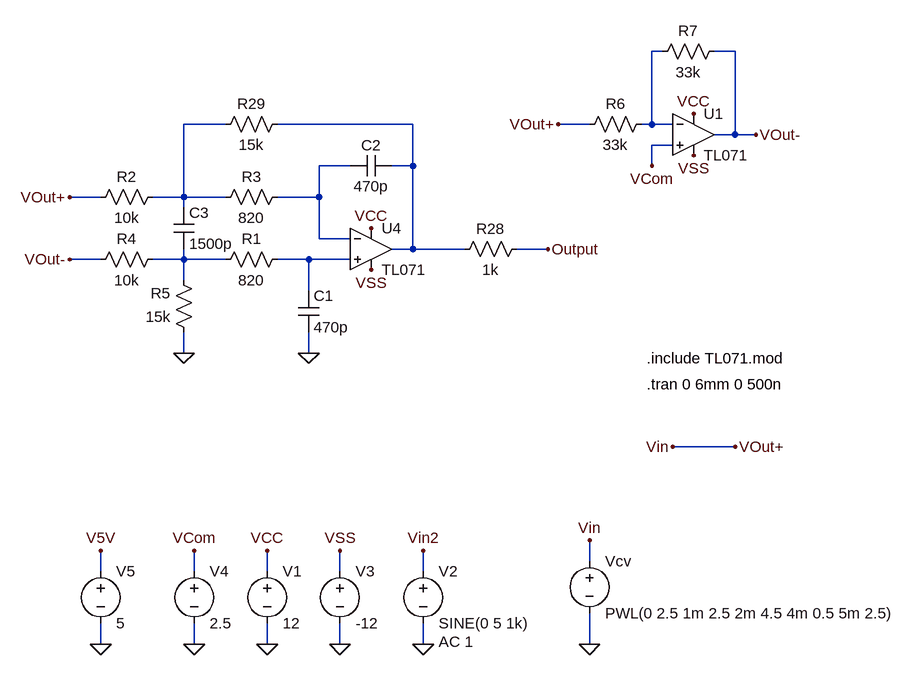
[diagram p0: schematic CodecOutput.asc]
CodecOutput.asc, the LTspice schematic file:
Version 4
SHEET 1 5572 1568
WIRE 4736 0 4720 0
WIRE 4848 0 4816 0
WIRE 4064 112 4000 112
WIRE 4352 112 4144 112
WIRE 4624 112 4576 112
WIRE 4720 112 4720 0
WIRE 4720 112 4704 112
WIRE 4752 112 4720 112
WIRE 4848 128 4848 0
WIRE 4848 128 4816 128
WIRE 4880 128 4848 128
WIRE 4752 144 4720 144
WIRE 4256 176 4208 176
WIRE 4352 176 4352 112
WIRE 4352 176 4320 176
WIRE 4720 176 4720 144
WIRE 3872 224 3824 224
WIRE 4000 224 4000 112
WIRE 4000 224 3952 224
WIRE 4064 224 4000 224
WIRE 4208 224 4208 176
WIRE 4208 224 4144 224
WIRE 4000 240 4000 224
WIRE 4208 288 4208 224
WIRE 4256 288 4208 288
WIRE 4352 304 4352 176
WIRE 4352 304 4320 304
WIRE 4432 304 4352 304
WIRE 4560 304 4512 304
WIRE 3872 320 3824 320
WIRE 4000 320 4000 304
WIRE 4000 320 3952 320
WIRE 4064 320 4000 320
WIRE 4192 320 4144 320
WIRE 4256 320 4192 320
WIRE 4000 352 4000 320
WIRE 4192 368 4192 320
WIRE 4000 464 4000 432
WIRE 4192 464 4192 432
WIRE 4848 608 4752 608
WIRE 4624 784 4624 752
WIRE 3872 800 3872 768
WIRE 4016 800 4016 768
WIRE 4128 800 4128 768
WIRE 4240 800 4240 768
WIRE 4368 800 4368 768
WIRE 3872 912 3872 880
WIRE 4016 912 4016 880
WIRE 4128 912 4128 880
WIRE 4240 912 4240 880
WIRE 4368 912 4368 880
WIRE 4624 912 4624 864
FLAG 4128 912 0
FLAG 4128 768 VCC
FLAG 4240 912 0
FLAG 4240 768 VSS
FLAG 4368 912 0
FLAG 4368 768 Vin2
FLAG 4624 912 0
FLAG 4624 752 Vin
FLAG 4288 336 VSS
FLAG 4288 272 VCC
FLAG 4560 304 Output
FLAG 3824 224 VOut+
FLAG 4016 912 0
FLAG 4016 768 VCom
FLAG 3872 912 0
FLAG 3872 768 V5V
FLAG 3824 320 VOut-
FLAG 4192 464 0
FLAG 4000 464 0
FLAG 4784 96 VCC
FLAG 4784 160 VSS
FLAG 4576 112 VOut+
FLAG 4880 128 VOut-
FLAG 4848 608 VOut+
FLAG 4752 608 Vin
FLAG 4720 176 VCom
SYMBOL voltage 4128 784 R0
WINDOW 123 0 0 Left 2
WINDOW 39 0 0 Left 2
SYMATTR InstName V1
SYMATTR Value 12
SYMBOL voltage 4368 784 R0
WINDOW 123 24 124 Left 2
WINDOW 39 0 0 Left 2
SYMATTR Value2 AC 1
SYMATTR InstName V2
SYMATTR Value SINE(0 5 1k)
SYMBOL voltage 4240 784 R0
WINDOW 123 0 0 Left 2
WINDOW 39 0 0 Left 2
SYMATTR InstName V3
SYMATTR Value -12
SYMBOL voltage 4624 768 R0
WINDOW 123 24 124 Left 2
WINDOW 39 0 0 Left 2
SYMATTR InstName Vcv
SYMATTR Value PWL(0 2.5 1m 2.5 2m 4.5 4m 0.5 5m 2.5)
SYMBOL opamp2 4288 240 R0
SYMATTR InstName U4
SYMATTR Value TL071
SYMBOL res 4528 288 R90
WINDOW 0 0 56 VBottom 2
WINDOW 3 32 56 VTop 2
SYMATTR InstName R28
SYMATTR Value 1k
SYMBOL res 4160 96 R90
WINDOW 0 0 56 VBottom 2
WINDOW 3 32 56 VTop 2
SYMATTR InstName R29
SYMATTR Value 15k
SYMBOL cap 4320 160 R90
WINDOW 0 0 32 VBottom 2
WINDOW 3 32 32 VTop 2
SYMATTR InstName C2
SYMATTR Value 470p
SYMBOL voltage 4016 784 R0
WINDOW 123 0 0 Left 2
WINDOW 39 0 0 Left 2
SYMATTR InstName V4
SYMATTR Value 2.5
SYMBOL res 4160 208 R90
WINDOW 0 0 56 VBottom 2
WINDOW 3 32 56 VTop 2
SYMATTR InstName R3
SYMATTR Value 820
SYMBOL voltage 3872 784 R0
WINDOW 123 0 0 Left 2
WINDOW 39 0 0 Left 2
SYMATTR InstName V5
SYMATTR Value 5
SYMBOL res 4160 304 R90
WINDOW 0 0 56 VBottom 2
WINDOW 3 32 56 VTop 2
SYMATTR InstName R1
SYMATTR Value 820
SYMBOL cap 4176 368 R0
SYMATTR InstName C1
SYMATTR Value 470p
SYMBOL res 3968 208 R90
WINDOW 0 0 56 VBottom 2
WINDOW 3 32 56 VTop 2
SYMATTR InstName R2
SYMATTR Value 10k
SYMBOL res 3968 304 R90
WINDOW 0 0 56 VBottom 2
WINDOW 3 32 56 VTop 2
SYMATTR InstName R4
SYMATTR Value 10k
SYMBOL cap 3984 240 R0
SYMATTR InstName C3
SYMATTR Value 1500p
SYMBOL res 4016 448 R180
WINDOW 0 36 76 Left 2
WINDOW 3 36 40 Left 2
SYMATTR InstName R5
SYMATTR Value 15k
SYMBOL opamp2 4784 64 R0
SYMATTR InstName U1
SYMATTR Value TL071
SYMBOL res 4720 96 R90
WINDOW 0 0 56 VBottom 2
WINDOW 3 32 56 VTop 2
SYMATTR InstName R6
SYMATTR Value 33k
SYMBOL res 4832 -16 R90
WINDOW 0 0 56 VBottom 2
WINDOW 3 32 56 VTop 2
SYMATTR InstName R7
SYMATTR Value 33k
TEXT 4712 472 Left 2 !.include TL071.mod
TEXT 4712 512 Left 2 !.tran 0 6mm 0 500n

The netlist it stands for:
* CodecOutput.asc
V1 VCC 0 12
V2 Vin2 0 SINE(0 5 1k) AC 1
V3 VSS 0 -12
Vcv VOut+ 0 PWL(0 2.5 1m 2.5 2m 4.5 4m 0.5 5m 2.5)
XU4 N006 N004 VCC VSS N003 TL071  ; pins In+ In- V+ V- OUT
R28 Output N003 1k
R29 N003 N002 15k
C2 N003 N004 470p
V4 VCom 0 2.5
R3 N004 N002 820
V5 V5V 0 5
R1 N006 N005 820
C1 N006 0 470p
R2 N002 VOut+ 10k
R4 N005 VOut- 10k
C3 N002 N005 1500p
R5 0 N005 15k
XU1 VCom N001 VCC VSS VOut- TL071  ; pins In+ In- V+ V- OUT
R6 N001 VOut+ 33k
R7 VOut- N001 33k
.include TL071.mod
.tran 0 6mm 0 500n
.backanno
.end